# EAGLE design Adafruit FPC Breakout - Pi 5 DSI - RP2350 HSTX (EAGLE 9.6.2)
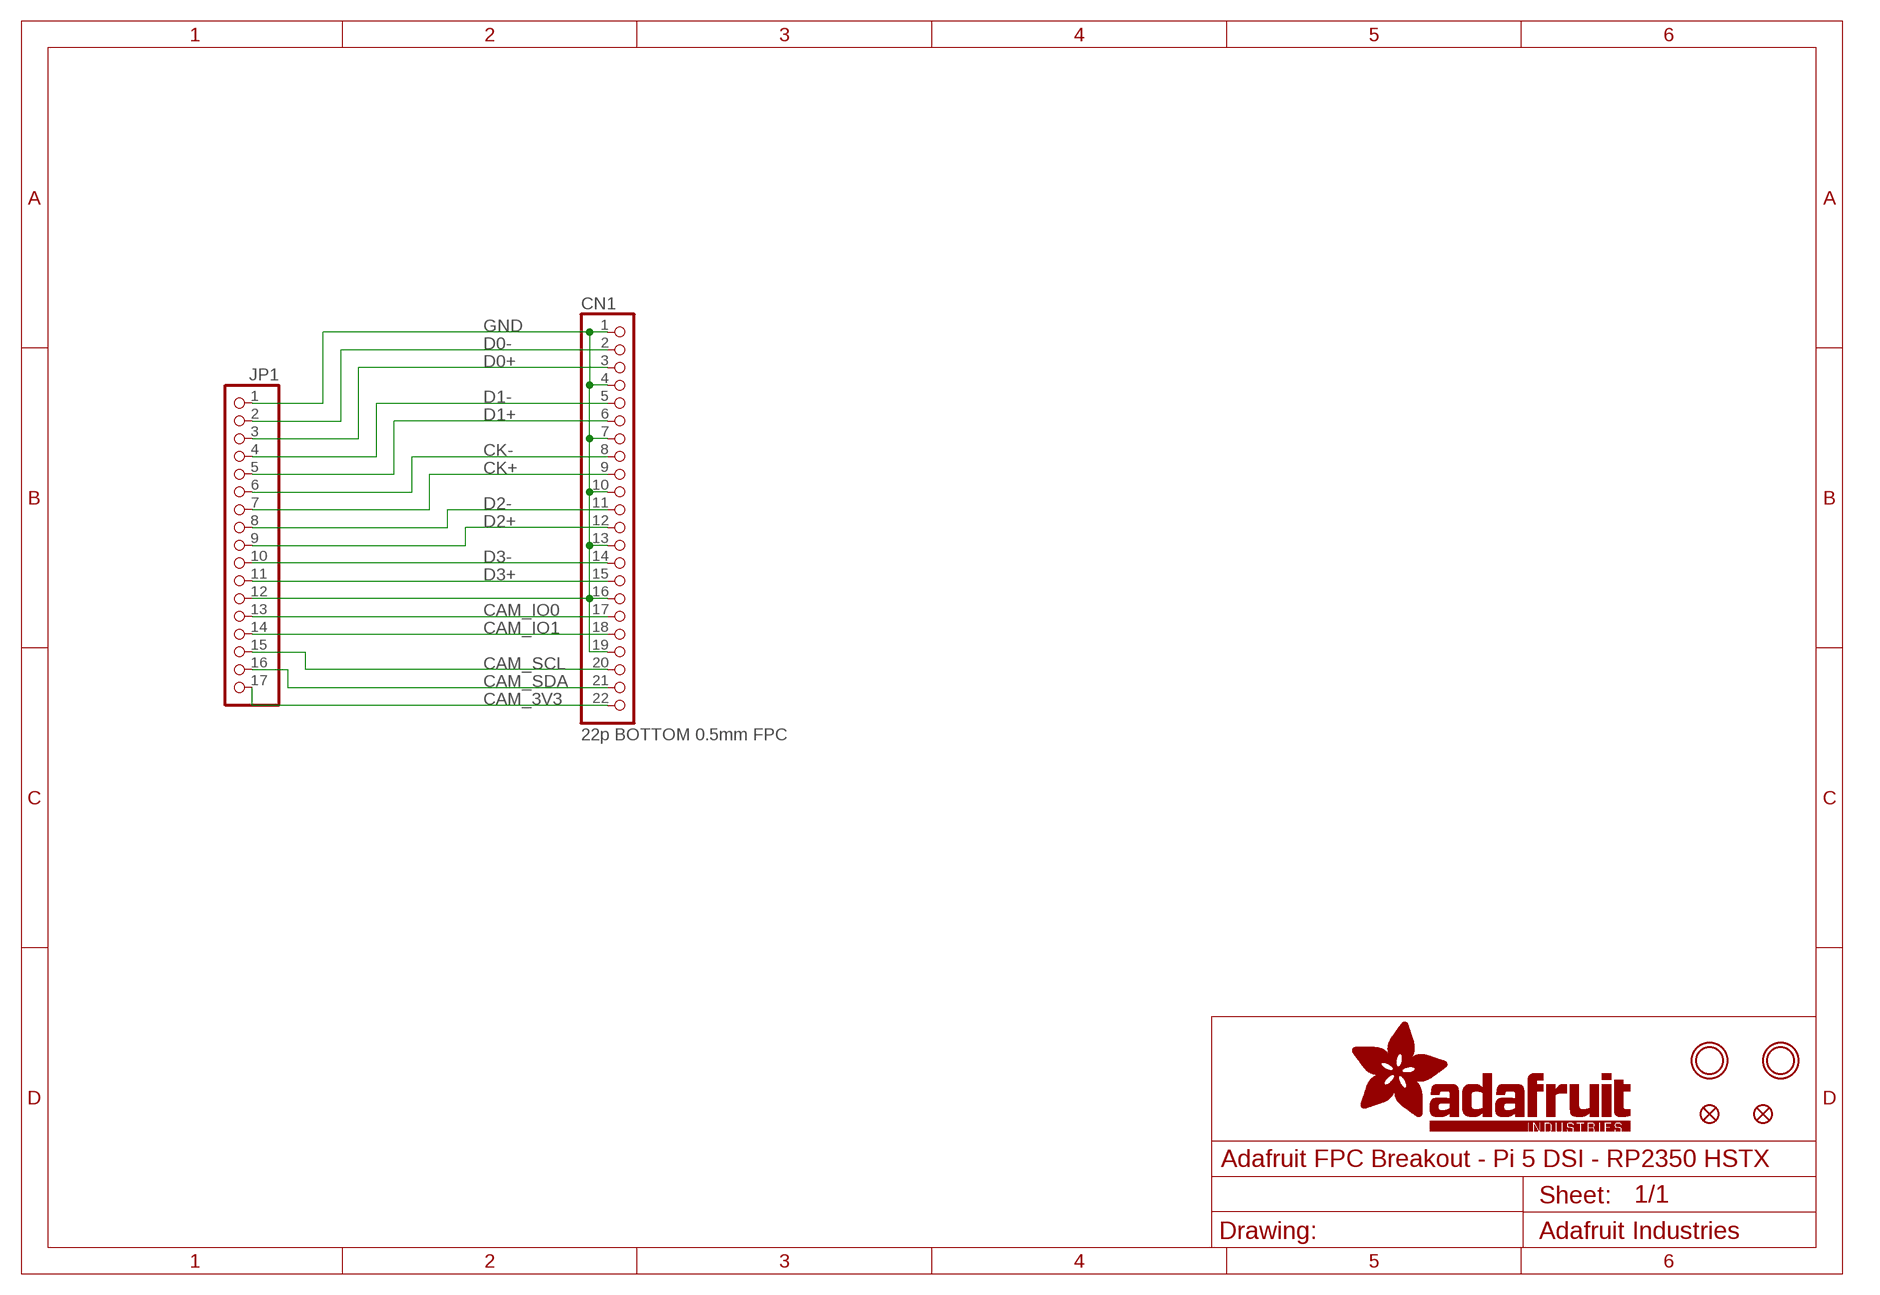
[diagram p0: schematic, sheet 1]

## Parts
CN1  22p BOTTOM 0.5mm FPC  HEADER-1X22_22PIN_0.5MM_BOT  [FPC_22PIN]
FID1  FIDUCIAL_1MM  [FIDUCIAL_1MM]
FID2  FIDUCIAL_1MM  [FIDUCIAL_1MM]
JP1  HEADER-1X17  [1X17_ROUND70]
U$2  MOUNTINGHOLE2.5  [MOUNTINGHOLE_2.5_PLATED]
U$3  MOUNTINGHOLE2.5  [MOUNTINGHOLE_2.5_PLATED]

## Nets
CAM_3V3: CN1.22 JP1.17
CAM_IO0: CN1.17 JP1.13
CAM_IO1: CN1.18 JP1.14
CAM_SCL: CN1.20 JP1.15
CAM_SDA: CN1.21 JP1.16
CK+: CN1.9 JP1.7
CK-: CN1.8 JP1.6
D0+: CN1.3 JP1.3
D0-: CN1.2 JP1.2
D1+: CN1.6 JP1.5
D1-: CN1.5 JP1.4
D2+: CN1.12 JP1.9
D2-: CN1.11 JP1.8
D3+: CN1.15 JP1.11
D3-: CN1.14 JP1.10
GND: CN1.1 CN1.4 CN1.7 CN1.10 CN1.13 CN1.16 CN1.19 JP1.1 JP1.12

## Library data of the parts
CN1 = adafruit_electromech:HEADER-1X22
FID1 FID2 = microbuilder:FIDUCIAL: Fiducial Alignment Points Various fiducial points for machine vision alignment.; BOM: EXCLUDE
JP1 = microbuilder:HEADER-1X17: Header 1x17
U$2 U$3 = adafruit_electromech:MOUNTINGHOLE: Mounting Hole For #2 screws (0.086"/2.18mm width, 0.094"/2.4mm hole) use 2.5mm; BOM: EXCLUDE

## Board
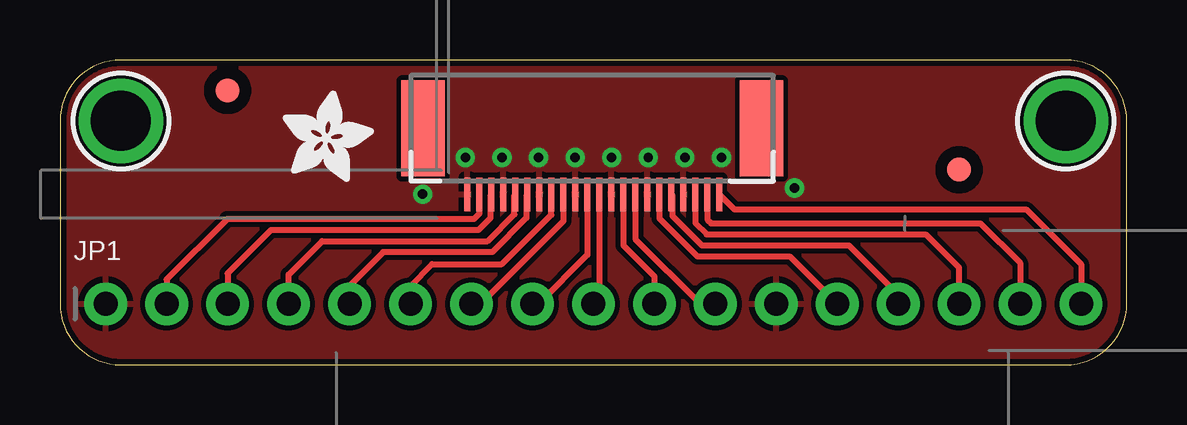
[diagram p1: board, top side]
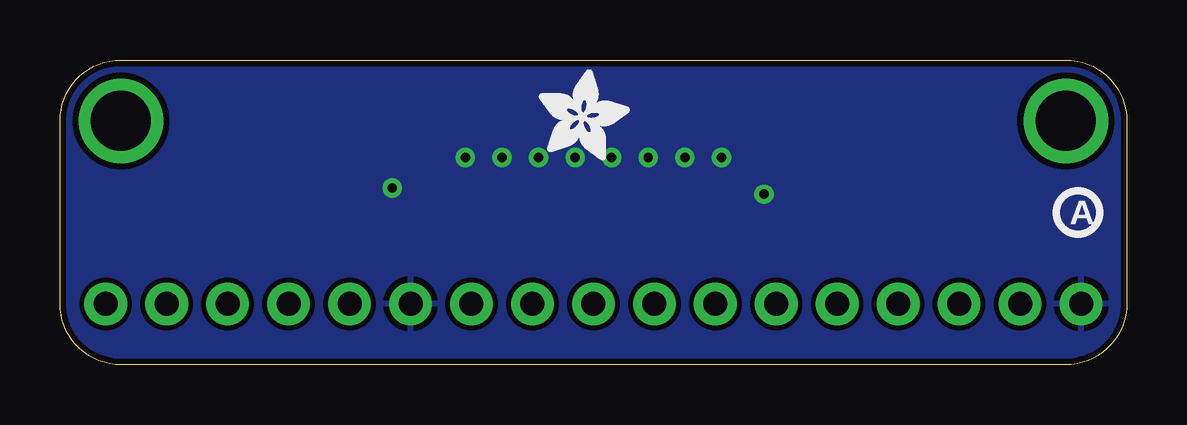
[diagram p2: board, bottom side, seen from below]

Size 44.45 x 12.7 mm. Coordinates in mm from the lower left corner, seen from the top.
Outline: 0,10.16 0,2.54 arc90 2.54,0 41.91,0 arc90 44.45,2.54 44.45,10.16 arc90 41.91,12.7 2.54,12.7 arc90 0,10.16
Copper layers (1*16): Top 0.035mm / dielectric 1.5mm / Bottom 0.035mm
Design rules "adafruit 8-8": minimum track width 6mil, minimum drill 15.5mil, track to track 8mil, track to pad 8mil, pad to pad 8mil, via to via 8mil, smd to smd 8mil, copper to edge 10mil, drill to drill 8mil, minimum pad ring 10mil, minimum via ring 8mil, stop-mask expansion 2mil, vias tented up to drill 20mil, thermal gap 10mil

### Footprints (pad centres in the part's own frame; a part is rotated, then mirrored left to right if it is on the bottom)
FPC_22PIN = smd 0.25 x 1.4: 1 -5.25,-1.154; 2 -4.75,-1.154; 3 -4.25,-1.154; 4 -3.75,-1.154; 5 -3.25,-1.154; 6 -2.75,-1.154; 7 -2.25,-1.154; 8 -1.75,-1.154; 9 -1.25,-1.154; 10 -0.75,-1.154; 11 -0.25,-1.154; 12 0.25,-1.154; 13 0.75,-1.154; 14 1.25,-1.154; 15 1.75,-1.154; 16 2.25,-1.154; 17 2.75,-1.154; 18 3.25,-1.154; 19 3.75,-1.154; 20 4.25,-1.154; 21 4.75,-1.154; 22 5.25,-1.154 | smd 1.8 x 4: SUPPORT1 7,1.598; SUPPORT2 -7.1,1.598
FIDUCIAL_1MM = smd 1 x 1: 1 0,0
1X17_ROUND70 = drill 1 pad 1.778: 1 -20.32,0; 2 -17.78,0; 3 -15.24,0; 4 -12.7,0; 5 -10.16,0; 6 -7.62,0; 7 -5.08,0; 8 -2.54,0; 9 0,0; 10 2.54,0; 11 5.08,0; 12 7.62,0; 13 10.16,0; 14 12.7,0; 15 15.24,0; 16 17.78,0; 17 20.32,0
MOUNTINGHOLE_2.5_PLATED = drill 2.5 pad 3.2: P$1 0,0

### Placement (x,y rotation side)
CN1  22.23,8.26 0 top
FID1  6.99,11.43 0 top
FID2  37.47,8.13 0 top
JP1  22.23,2.54 0 top
PLABEL1  [PLABEL1]  15.75,6.35 0 top
PLABEL2  [PLABEL2]  1.91,3.81 90 top
PLABEL3  [PLABEL3]  29.84,3.81 90 top
PLABEL4  [PLABEL4]  4.45,3.81 90 top
PLABEL5  [PLABEL5]  6.99,3.81 90 top
PLABEL6  [PLABEL6]  12.06,3.81 90 top
PLABEL7  [PLABEL7]  9.53,3.81 90 top
PLABEL8  [PLABEL8]  14.61,3.81 90 top
PLABEL9  [PLABEL9]  20.83,4.32 0 top
PLABEL10  [PLABEL10]  23.75,1.02 0 top
PLABEL11  [PLABEL11]  25.78,4.32 0 top
PLABEL12  [PLABEL12]  16,4.32 0 top
PLABEL13  [PLABEL13]  18.67,1.02 0 top
PLABEL14  [PLABEL14]  32.38,3.81 90 top
PLABEL15  [PLABEL15]  34.92,3.81 90 top
PLABEL16  [PLABEL16]  37.47,3.81 90 top
PLABEL17  [PLABEL17]  40.01,3.81 90 top
PLABEL18  [PLABEL18]  42.55,3.81 90 top
PLABEL19  [PLABEL19]  31.37,9.4 0 top
PLABEL20  [PLABEL20]  22.23,6.1 0 bottom
U$2  2.54,10.16 0 top
U$3  41.91,10.16 0 top
U$4  [ADAFRUIT_3.5MM]  9.27,7.62 0 top
U$5  [ADAFRUIT_3.5MM]  24.51,8.51 0 bottom
U$6  [PCBFEAT-REV-040]  2.03,6.35 0 bottom

### Tracks (layer width: path | path; a pad name or v marks a point on that pad's centre or on a via)
CAM_3V3
  Top 0.254: CN1.22 28.1,6.48 40.26,6.48 42.55,4.19 JP1.17
CAM_IO0
  Top 0.254: CN1.17 24.98,6.11 26.56,4.52 30.4,4.52 JP1.13
CAM_IO1
  Top 0.254: CN1.18 25.52,7.06 25.52,6.21 26.75,4.98 32.87,4.98 34.92,2.92 JP1.14
CAM_SCL
  Top 0.254: JP1.15 37.47,4.04 36.07,5.44 26.94,5.44 26.48,5.9 CN1.20
CAM_SDA
  Top 0.254: CN1.21 26.98,6.04 27.13,5.89 38.35,5.89 40.01,4.24 JP1.16
CK+
  Top 0.254: CN1.9 20.98,5.99 17.53,2.54 JP1.7
CK-
  Top 0.254: JP1.6 14.61,3.3 15.49,4.19 18.41,4.19 20.48,6.25 CN1.8
D0+
  Top 0.254: CN1.3 17.93,7.06 17.93,6.11 17.44,5.61 8.79,5.61 6.99,3.81 JP1.3
D0-
  Top 0.254: CN1.2 17.48,6.3 17.25,6.07 6.96,6.07 4.45,3.56 JP1.2
D1+
  Top 0.254: CN1.6 19.43,7.06 19.43,6.12 18.01,4.7 13.46,4.7 12.06,3.3 JP1.5
D1-
  Top 0.254: JP1.4 9.53,3.76 10.92,5.16 17.82,5.16 18.93,6.26 18.93,7.06 CN1.5
D2+
  Top 0.254: CN1.12 22.48,2.79 JP1.9
D2-
  Top 0.254: CN1.11 21.98,4.58 19.94,2.54 JP1.8
D3+
  Top 0.254: CN1.15 23.98,5.24 26.67,2.54 JP1.11
D3-
  Top 0.254: CN1.14 23.48,4.97 24.77,3.68 JP1.10
GND  (via drill 0.39)
  other vias: 16.89,8.64 18.41,8.64 19.94,8.64 21.46,8.64 22.99,8.64 24.51,8.64 26.04,8.64 27.56,8.64 15.11,7.11 30.61,7.37
  pour Top: 0,12.7 44.45,12.7 44.45,0 0,0
  pour Bottom: 0,12.7 44.45,12.7 44.45,0 0,0

### Text on the board
Pinguin_tBackup: 1 | Pi CSI/DSI Adapter | 22-Pin / Raspi / FPC | 1 | GND | D0- | D0+ | D1- | D1+ | CK- | CK+ | D2- | D2+ | D3- | D3+ | GND | IO0 | IO1 | SCL | SDA | 3.3V
Pinguin_bBackup: Camera & Display / 15 Pin 1mm Pitch / 22 Pin 0.5mm Pitch / Cable Adapter / For Raspbery Pi | 4-Lane High-Speed CSI/DSI/HSTX / 22-pin 0.5mm FPC Breakout Board